# EAGLE design main v0.03 (EAGLE 6.3)
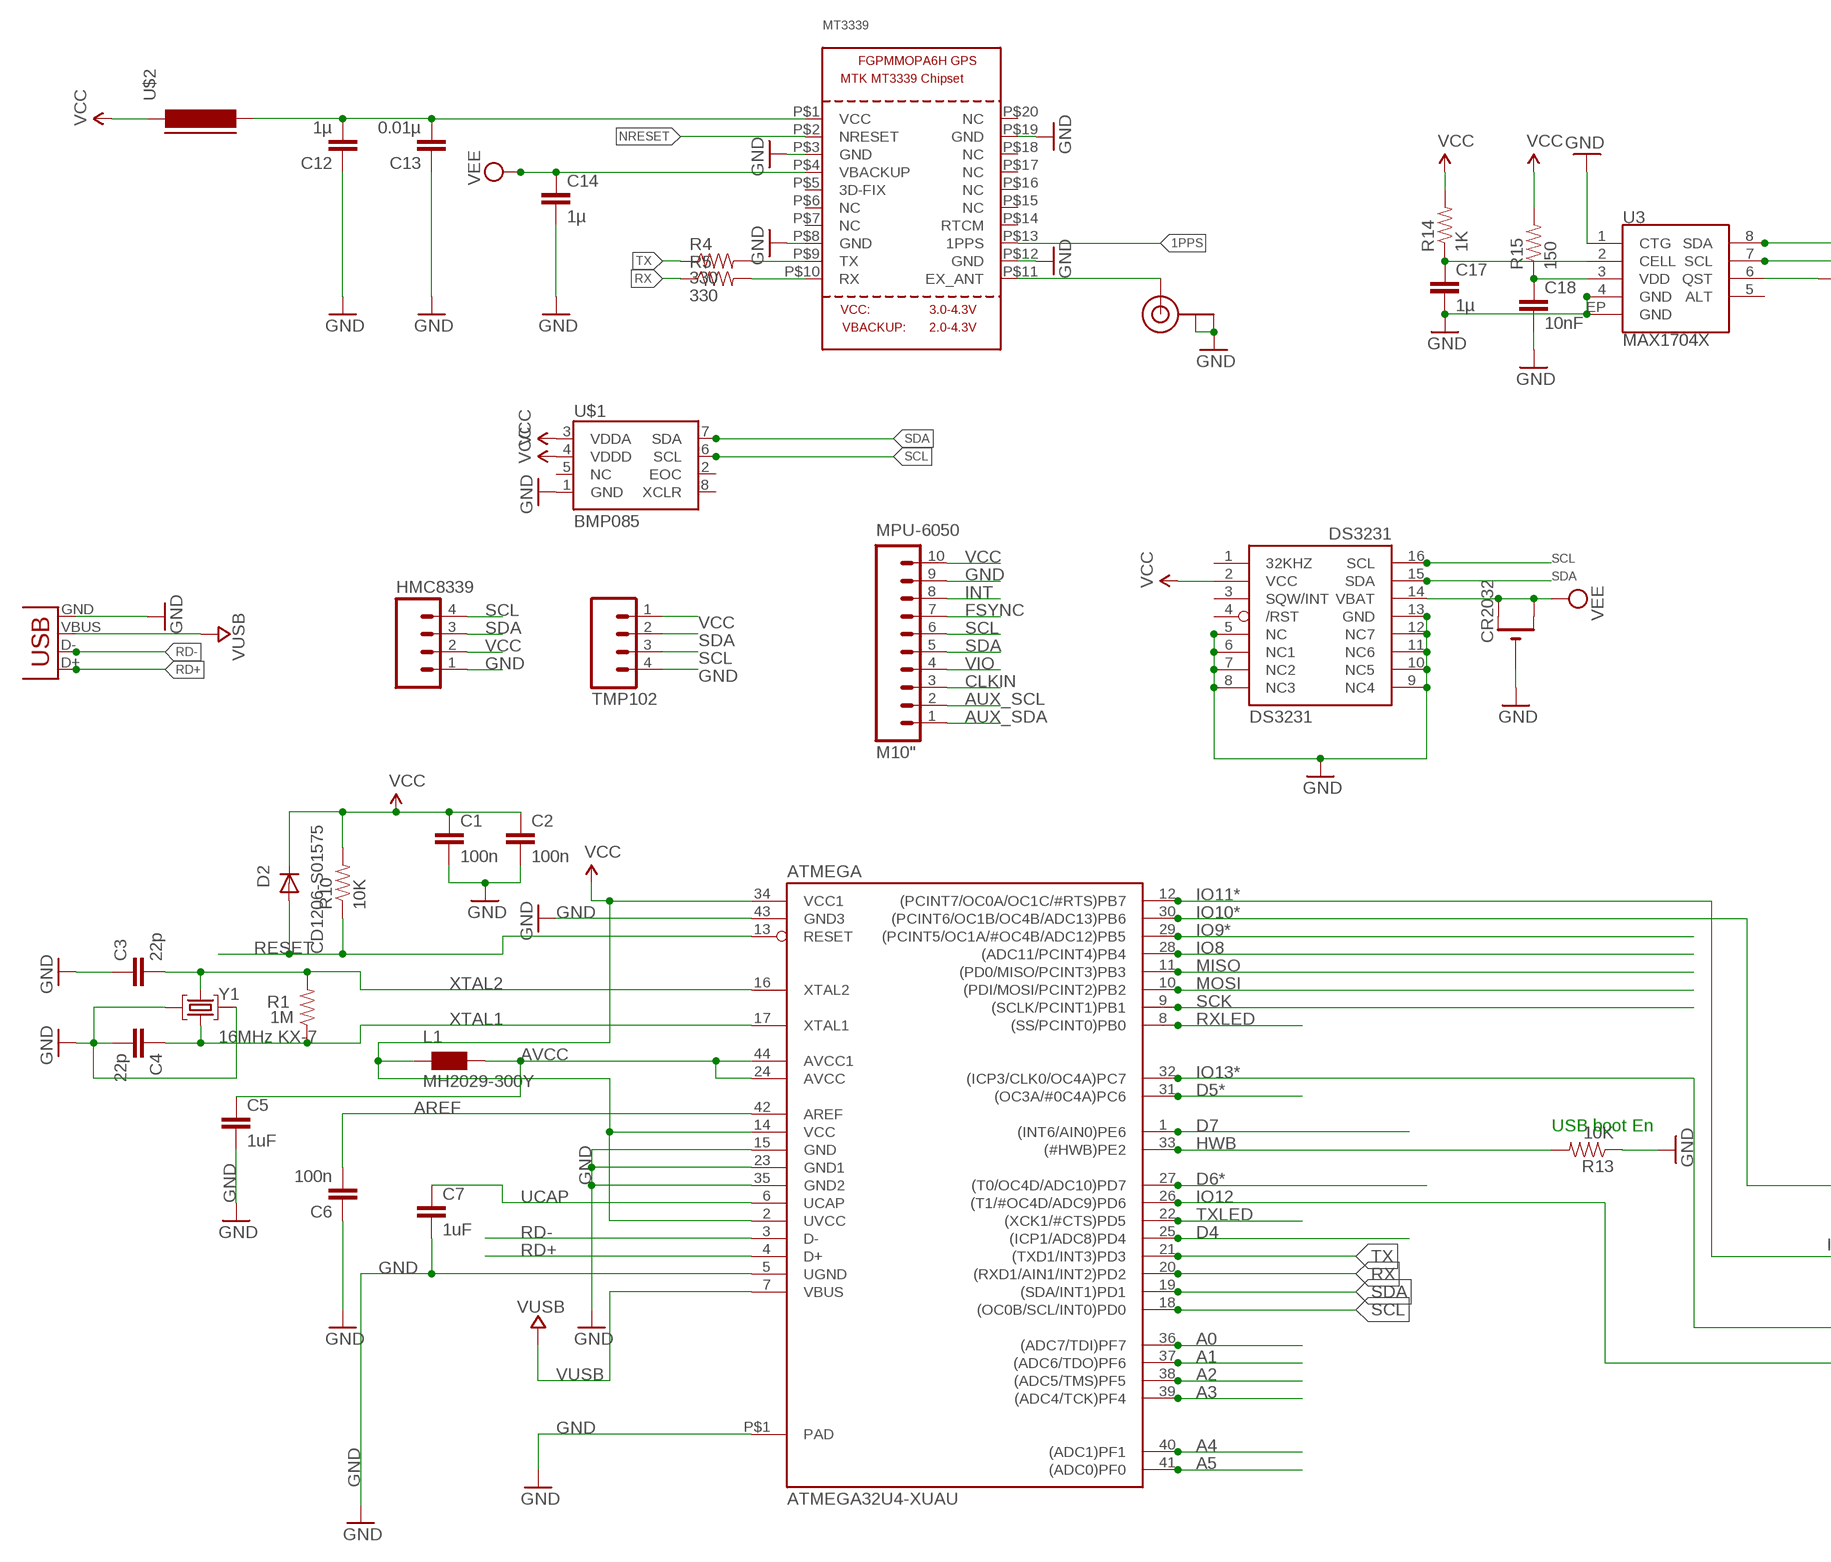
[diagram p0: schematic, sheet 1, part 1 of 2]
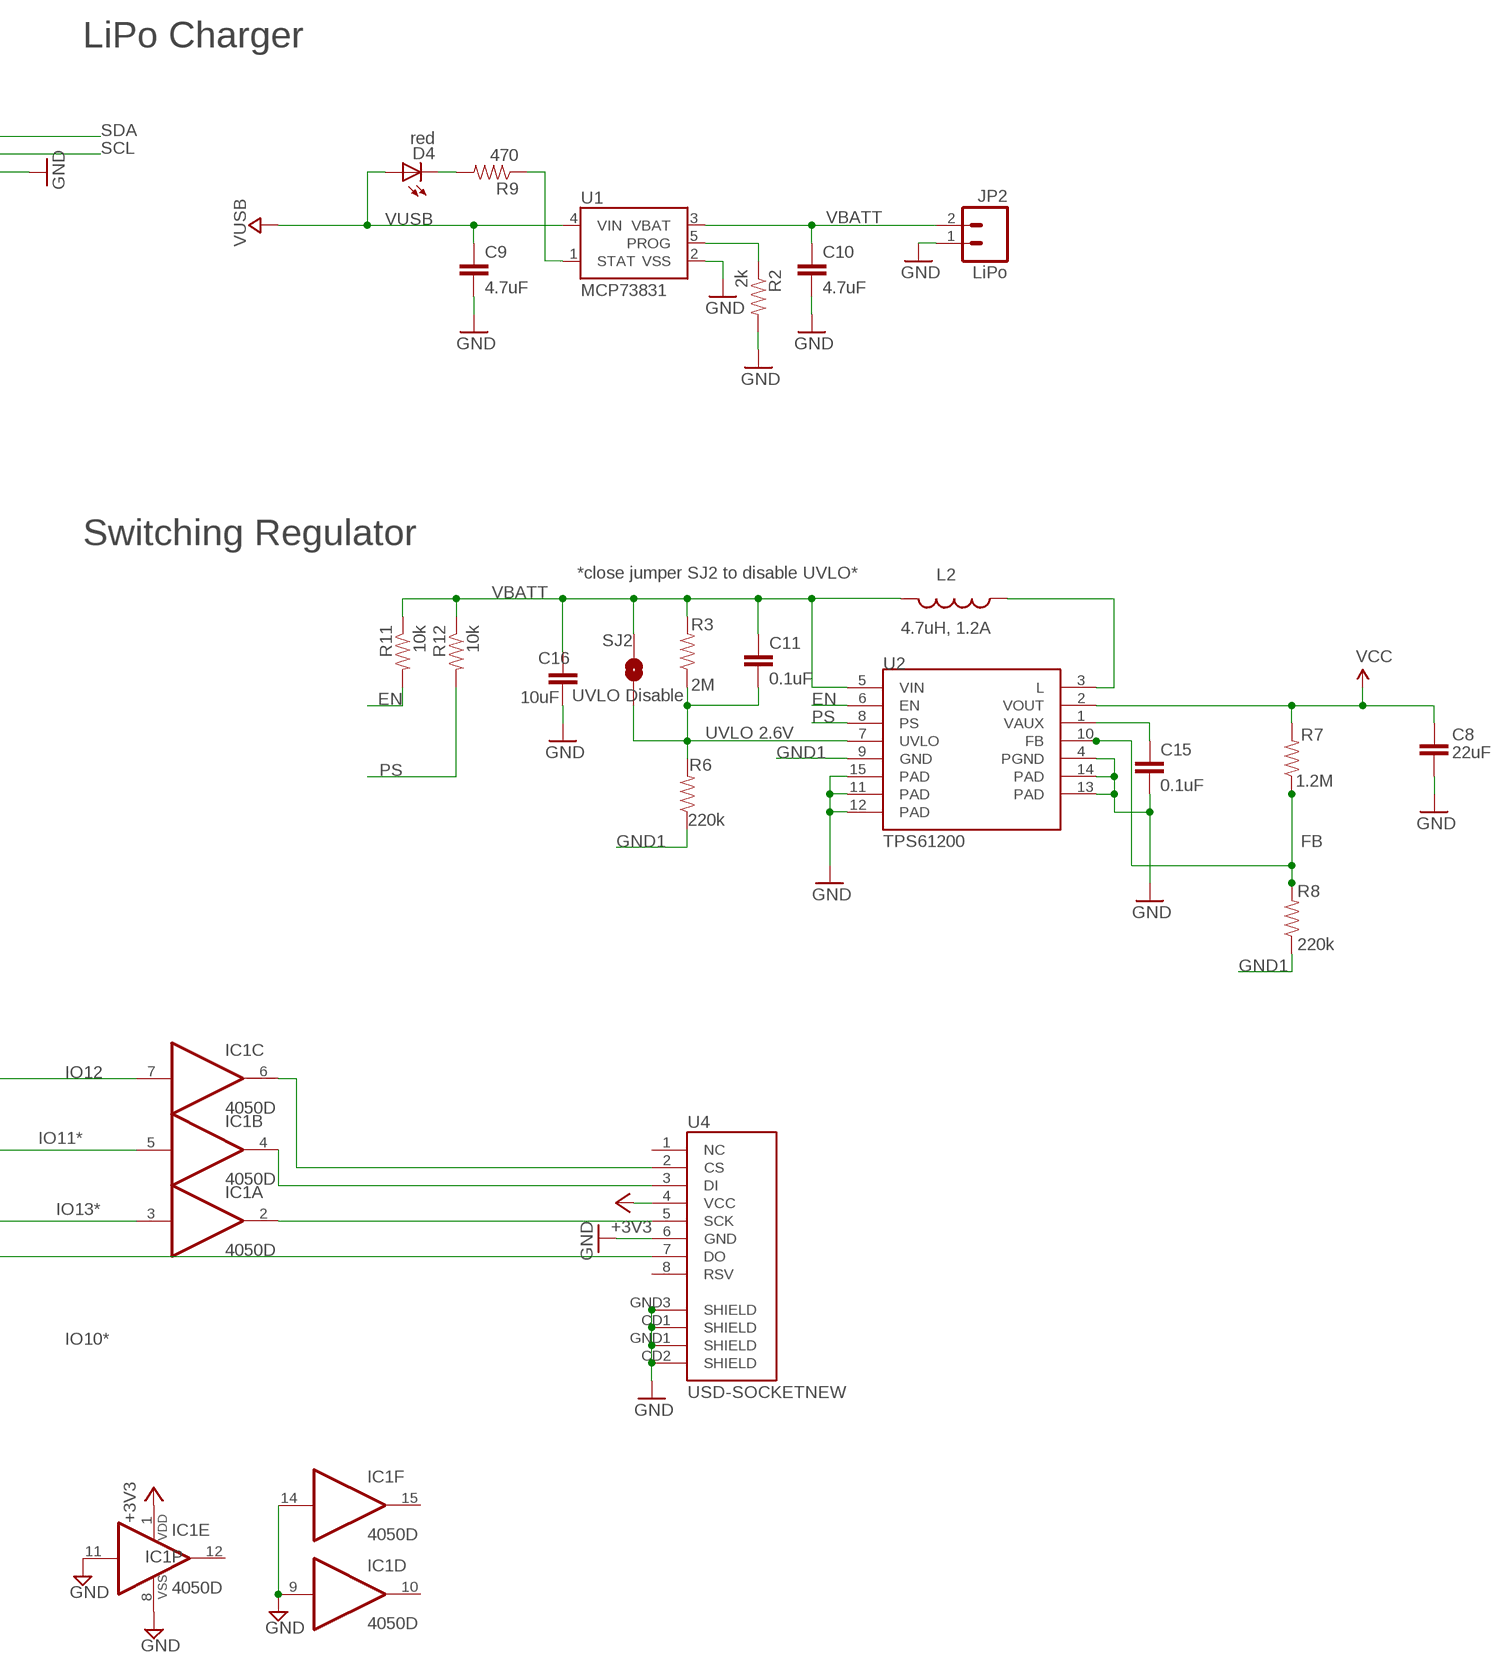
[diagram p1: schematic, sheet 1, part 2 of 2]

## Parts
ATMEGA  ATMEGA32U4-XUAU  [TQFP44-PAD]
C1  100n  CAP0805  [0805]
C2  100n  CAP0805  [0805]
C3  22p  CAP0805  [0805]
C4  22p  CAP0805  [0805]
C5  1uF  CAP0805  [0805]
C6  100n  CAP0805  [0805]
C7  1uF  CAP0805  [0805]
C8  22uF  CAP0805  [0805]
C9  4.7uF  CAP0805  [0805]
C10  4.7uF  CAP0805  [0805]
C11  0.1uF  CAP0805  [0805]
C12  1µ  CAP0805  [0805]
C13  0.01µ  CAP0805  [0805]
C14  1µ  CAP0805  [0805]
C15  0.1uF  CAP0805  [0805]
C16  10uF  CAP0805  [0805]
C17  1µ  CAP0805  [0805]
C18  10nF  CAP0805  [0805]
CR2032  CR2032SMT  [CR2032-SMD]
D2  CD1206-S01575  DIODE-MINIMELF  [MINIMELF]
D4  red  LED1206  [LED-1206]
DS3231  DS3231/SO  [SO16W]
HMC8339  M04PTH  [1X04]
IC1  4050D  [SO16]
JP2  LiPo  M02-JST-2MM-SMT  [JST-2-SMD]
L1  MH2029-300Y  WE-CBF_0805  [0805]
L2  4.7uH, 1.2A  INDUCTOR.  [CDRH2D09]
MPU-6050  M10"  [1X10]
MT3339  GPS_FGPMMOPA6H  [FGPMMOPA6H]
R1  1M  RESISTOR0805-RES  [0805]
R2  2k  RESISTOR0805-RES  [0805]
R3  2M  RESISTOR0805-RES  [0805]
R4  330  RESISTOR0805-RES  [0805]
R5  330  RESISTOR0805-RES  [0805]
R6  220k  RESISTOR0805-RES  [0805]
R7  1.2M  RESISTOR0805-RES  [0805]
R8  220k  RESISTOR0805-RES  [0805]
R9  470  RESISTOR0805-RES  [0805]
R10  10K  RESISTOR0805-RES  [0805]
R11  10k  RESISTOR0805-RES  [0805]
R12  10k  RESISTOR0805-RES  [0805]
R13  10K  RESISTOR0805-RES  [0805]
R14  1K  RESISTOR0805-RES  [0805]
R15  150  RESISTOR0805-RES  [0805]
SJ2  UVLO Disable  SOLDERJUMPERNO  [SJ_2S-NO]
TMP102  M04PTH  [1X04]
U1  MCP73831  [SOT23-5]
U2  TPS61200  [QFN-10_PAD]
U3  MAX1704X  [TDFN-8]
U4  USD-SOCKETNEW  [MICRO-SD-SOCKET-PP]
U$1  BMP085  [BMP085]
U$2  FERRITE-1206  [FB1206]
U$3  U.FL  [U.FL]
X1  USB-MICROB  [USB-MICROB]
Y1  16MHz KX-7  CRYSTAL-3.2-2.5  [CRYSTAL-3.2-2.5]

## Nets
1PPS: MT3339.P$13(1PPS)
+3V3: IC1.1(P:VDD) U4.4(VCC)
A0: ATMEGA.36((ADC7/TDI)PF7)
A1: ATMEGA.37((ADC6/TDO)PF6)
A2: ATMEGA.38((ADC5/TMS)PF5)
A3: ATMEGA.39((ADC4/TCK)PF4)
A4: ATMEGA.40((ADC1)PF1)
A5: ATMEGA.41((ADC0)PF0)
AREF: ATMEGA.42(AREF) C6.2
AUX_SCL: MPU-6050.2
AUX_SDA: MPU-6050.1
AVCC: ATMEGA.24(AVCC) ATMEGA.44(AVCC1) C5.1 L1.2
CLKIN: MPU-6050.3
D4: ATMEGA.25((ICP1/ADC8)PD4)
D5*: ATMEGA.31((OC3A/#0C4A)PC6)
D6*: ATMEGA.27((T0/OC4D/ADC10)PD7)
D7: ATMEGA.1((INT6/AIN0)PE6)
EN: R11.2 U2.6(EN)
FB: R7.1 R8.2 U2.10(FB)
FSYNC: MPU-6050.7
GND: ATMEGA.5(UGND) ATMEGA.15(GND) ATMEGA.23(GND1) ATMEGA.35(GND2) ATMEGA.43(GND3) ATMEGA.P$1(PAD) C1.2 C2.2 C3.1 C4.2 C5.2 C6.1 C7.2 C8.2 C9.2 C10.2 C12.1 C13.1 C14.2 C15.2 C16.2 C17.2 C18.2 CR2032.- DS3231.5(NC) DS3231.6(NC1) DS3231.7(NC2) DS3231.8(NC3) DS3231.9(NC4) DS3231.10(NC5) DS3231.11(NC6) DS3231.12(NC7) DS3231.13(GND) HMC8339.1 IC1.8(P:VSS) IC1.9(D:I) IC1.11(E:I) IC1.14(F:I) JP2.1 MPU-6050.9 MT3339.P$3(GND) MT3339.P$8(GND) MT3339.P$12(GND) MT3339.P$19(GND) R2.2 R13.1 TMP102.4 U1.2(VSS) U2.4(PGND) U2.11(PAD) U2.12(PAD) U2.13(PAD) U2.14(PAD) U2.15(PAD) U3.1(CTG) U3.4(GND) U3.6(QST) U3.EP(GND) U4.6(GND) U4.CD1(SHIELD) U4.CD2(SHIELD) U4.GND1(SHIELD) U4.GND3(SHIELD) U$1.1(GND) U$3.P$1(GND) U$3.P$2(GND) X1.GND Y1.2(GND) Y1.4(GND)
GND1: R6.1 R8.1 U2.9(GND)
HWB: ATMEGA.33((#HWB)PE2) R13.2
INT: MPU-6050.8
IO8: ATMEGA.28((ADC11/PCINT4)PB4)
IO9*: ATMEGA.29((PCINT5/OC1A/#OC4B/ADC12)PB5)
IO10*: ATMEGA.30((PCINT6/OC1B/OC4B/ADC13)PB6) IC1.7(C:I)
IO11*: ATMEGA.12((PCINT7/OC0A/OC1C/#RTS)PB7) IC1.5(B:I)
IO12: ATMEGA.26((T1/#OC4D/ADC9)PD6) U4.7(DO)
IO13*: ATMEGA.32((ICP3/CLK0/OC4A)PC7) IC1.3(A:I)
MISO: ATMEGA.11((PD0/MISO/PCINT3)PB3)
MOSI: ATMEGA.10((PDI/MOSI/PCINT2)PB2)
N$1: MT3339.P$11(EX_ANT) U$3.P$3(SIGNAL)
N$2: D4.C R9.2
N$3: L2.P$1 U2.3(L)
N$4: C15.1 U2.1(VAUX)
N$5: C17.1 R14.1 U3.2(CELL)
N$6: IC1.4(B:O) U4.3(DI)
N$7: MT3339.P$9(TX) R4.2
N$8: MT3339.P$10(RX) R5.2
N$9: C12.2 C13.2 MT3339.P$1(VCC) U$2.2
N$10: C18.1 R15.1 U3.3(VDD)
N$11: R2.1 U1.5(PROG)
N$12: IC1.2(A:O) U4.5(SCK)
N$13: IC1.6(C:O) U4.2(CS)
N$14: R9.1 U1.1(STAT)
NRESET: MT3339.P$2(NRESET)
PS: R12.2 U2.8(PS)
RD+: ATMEGA.4(D+) X1.D+
RD-: ATMEGA.3(D-) X1.D-
RESET: ATMEGA.13(RESET) D2.A R10.1
RX: ATMEGA.20((RXD1/AIN1/INT2)PD2) R5.1
RXLED: ATMEGA.8((SS/PCINT0)PB0)
SCK: ATMEGA.9((SCLK/PCINT1)PB1)
SCL: ATMEGA.18((OC0B/SCL/INT0)PD0) DS3231.16(SCL) HMC8339.4 MPU-6050.6 TMP102.3 U3.7(SCL) U$1.6(SCL)
SDA: ATMEGA.19((SDA/INT1)PD1) DS3231.15(SDA) HMC8339.3 MPU-6050.5 TMP102.2 U3.8(SDA) U$1.7(SDA)
TX: ATMEGA.21((TXD1/INT3)PD3) R4.1
TXLED: ATMEGA.22((XCK1/#CTS)PD5)
UCAP: ATMEGA.6(UCAP) C7.1
UVLO: C11.2 R3.1 R6.2 SJ2.1 U2.7(UVLO)
VBATT: C10.1 C11.1 C16.1 JP2.2 L2.P$2 R3.2 R11.1 R12.1 SJ2.2 U1.3(VBAT) U2.5(VIN)
VCC: ATMEGA.2(UVCC) ATMEGA.14(VCC) ATMEGA.34(VCC1) C1.1 C2.1 C8.1 D2.C DS3231.2(VCC) HMC8339.2 L1.1 MPU-6050.10 R7.2 R10.2 R14.2 R15.2 TMP102.1 U2.2(VOUT) U$1.3(VDDA) U$1.4(VDDD) U$2.1
VEE: C14.1 CR2032.+$1(+) CR2032.+$2(+1) DS3231.14(VBAT) MT3339.P$4(VBACKUP)
VIO: MPU-6050.4
VUSB: ATMEGA.7(VBUS) C9.1 D4.A U1.4(VIN) X1.VBUS
XTAL1: ATMEGA.17(XTAL1) C4.1 R1.1 Y1.1(C1)
XTAL2: ATMEGA.16(XTAL2) C3.2 R1.2 Y1.3(C2)
Unconnected: DS3231.1(32KHZ) DS3231.3(SQW/INT) DS3231.4(/RST) IC1.10(D:O) IC1.12(E:O) IC1.15(F:O) MT3339.P$5(3D-FIX) MT3339.P$6(NC) MT3339.P$7(NC) MT3339.P$14(RTCM) MT3339.P$15(NC) MT3339.P$16(NC) MT3339.P$17(NC) MT3339.P$18(NC) MT3339.P$20(NC) U3.5(ALT) U4.1(NC) U4.8(RSV) U$1.2(EOC) U$1.5(NC) U$1.8(XCLR)

## Notes on the sheet
- LiPo Charger
- Switching Regulator
- *close jumper SJ2 to disable UVLO*
- UVLO 2.6V
- USB boot En

## Library data of the parts
ATMEGA = SmartPrj:ATMEGA32U4-XU
C1-C18 = SparkFun:CAP: Capacitor Standard 0603 ceramic capacitor, and 0.1" leaded capacitor.
CR2032 = adafruit:CR2032
D2 = diode:DIODE-: DIODE
D4 = SparkFun:LED: LEDs Standard schematic elements and footprints for 5mm, 3mm, 1206, and 0603 sized LEDs. 5mm - Spark Fun Electronics SKU : COM-00529 (and others)
DS3231 = adafruit:DS3231
HMC8339 TMP102 = SparkFun:M04: Header 4 Standard 4-pin 0.1" header. Use with straight break away headers (SKU : PRT-00116), right angle break away headers (PRT-00553), swiss pins (PRT-00743), machine pins (PRT-00117), and female headers (PRT-00115). Molex polarized connector foot print use with SKU : PRT-08231 with associated crimp pins and housings. 1MM SMD Version SKU: PRT-10208
IC1 = 40xx:4050: Hex non-inverting BUFFER
JP2 = SparkFun:M02: Header 2 Standard 2-pin 0.1" header. Use with straight break away headers (SKU : PRT-00116), right angle break away headers (PRT-00553), swiss pins (PRT-00743), machine pins (PRT-00117), and female headers (PRT-00115). Molex polarized connector foot print use with SKU : PRT-08233 with associated crimp pins and housings.
L1 = wuerth-elektronik:WE-CBF: SMD EMI Suppression Ferrite Beads - excellent anti-EMI properties - low DCR - impedances till 3000 ohms - rated current up to 6 A
L2 = SparkFun:INDUCTOR: Inductors Basic Inductor/Choke - 0603 and 1206. Footprints are not proven and vary greatly between part numbers.
MPU-6050 = SparkFun:M10: Header 10 Standard 10-pin 0.1" header. Use with straight break away headers (SKU : PRT-00116), right angle break away headers (PRT-00553), swiss pins (PRT-00743), machine pins (PRT-00117), and female headers (PRT-00115).
MT3339 = adafruit:GPS_FGPMMOPA6H: GPS Module - MTK MT3339 Chipset, -165dBm sensitivity, 22 channels, 10Hz, auto-select external antenna options
R1-R15 = SparkFun:RESISTOR: Resistor Basic schematic elements and footprints for 0603, 1206, and PTH resistors.
SJ2 = SparkFun-Passives:SOLDERJUMPER: Solder Jumper Standard SMD solder jumper. Used to automate production. Two varients : Normally Open and Normally Closed are the same, but have different paste layers. NC will have a large amount of paste and should jumper during reflow.
U1 = SparkFun:MCP73831: Microchip's MCP73831 Miniature single cell, fully integrated Li-Ion, Li-polymer charge management controller http://ww1.microchip.com/downloads/en/DeviceDoc/21984a.pdf
U2 = SparkFun:TPS61200: DC to DC Booster
U3 = SparkFun-PowerIC:MAX1704X: MAX17043/MAX17044: Battery Fuel Guage (43 is 1cell, 44 is 2cell)
U4 = SparkFun-Connectors:USD-SOCKET: microSD Socket Push-push type uSD socket. Schematic element and footprint production proven. Spark Fun Electronics SKU : PRT-00127. tDoc lines correctly indicate media card edge positions when inserting (unlocked, locked, depressed).
U$1 = SparkFun:BMP085: BMP085 Pressure Sensor Great little MEMS pressure sensor. SKU: COM-09603
U$2 = dp_devices:FERRITE: Ferrite bead in various packages
U$3 = SparkFun:U.FL
X1 = SparkFun:USB: USB Connectors USB-B-PTH is fully proven SKU : PRT-00139 USB-miniB is fully proven SKU : PRT-00587 USB-A-PCB is untested. USB-A-H is throughly reviewed, but untested. Spark Fun Electronics SKU : PRT-00437 USB-B-SMT is throughly reviewed, but untested. Needs silkscreen touching up. USB-A-S has not been used/tested USB-MB-H has not been used/tested
Y1 = SmartPrj:CRYSTAL-3.2-2.5

## Board
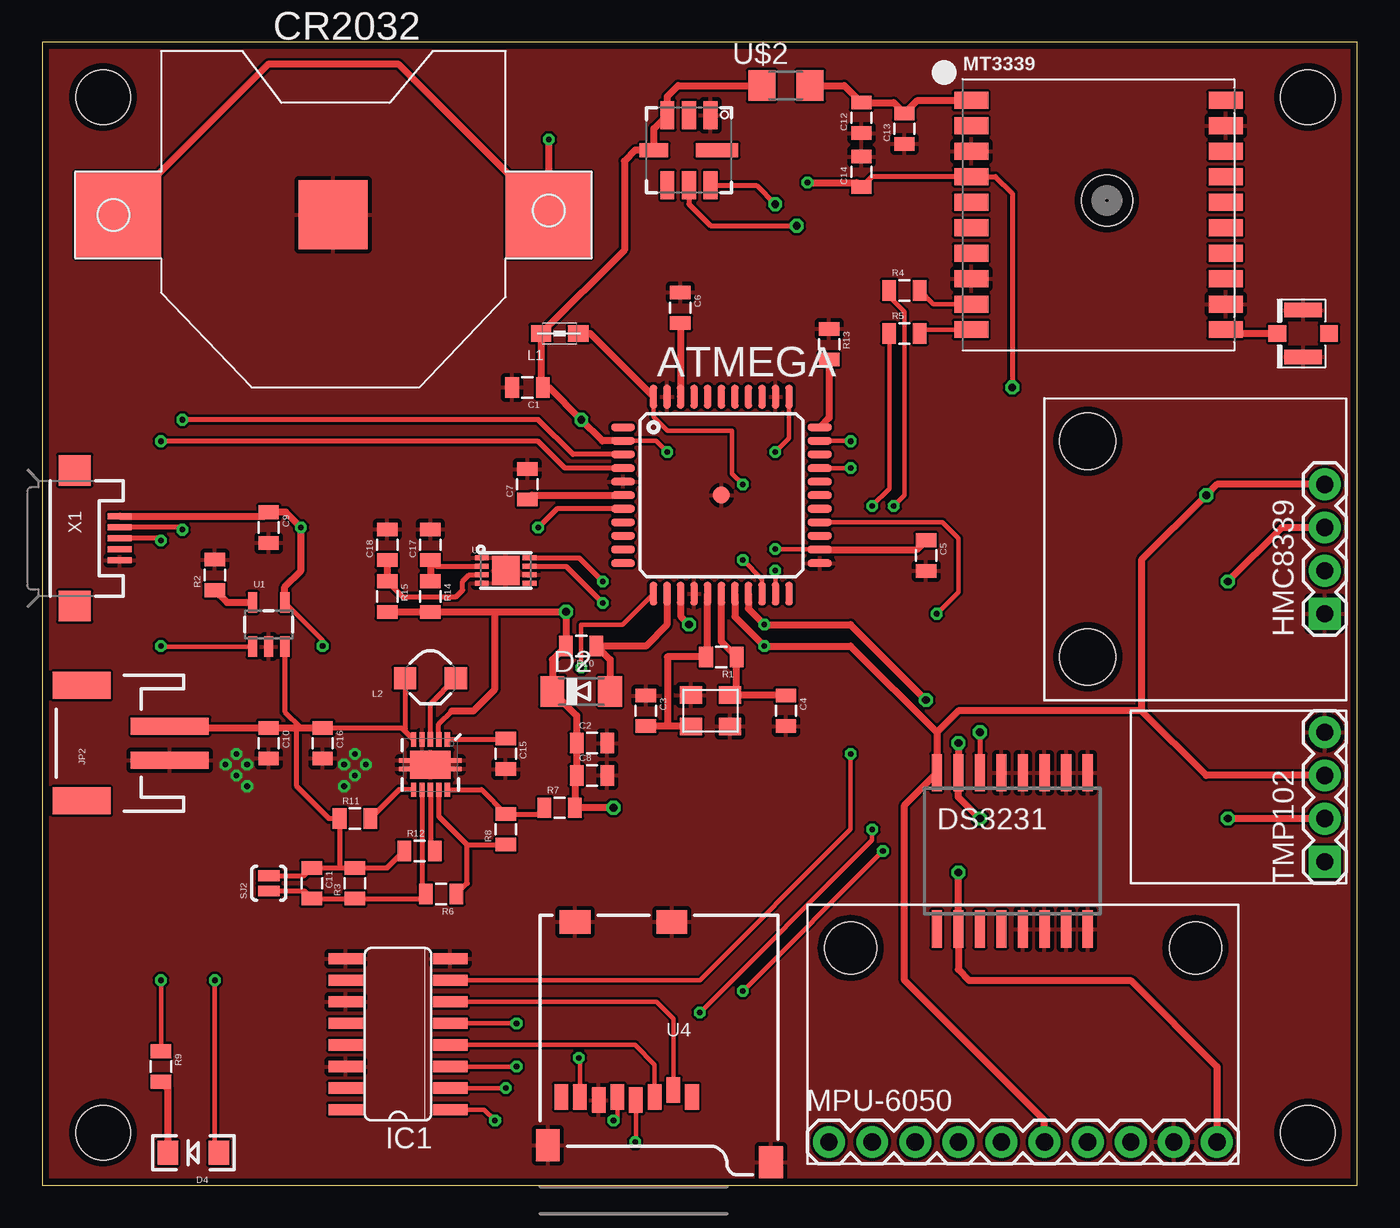
[diagram p2: board, top side]
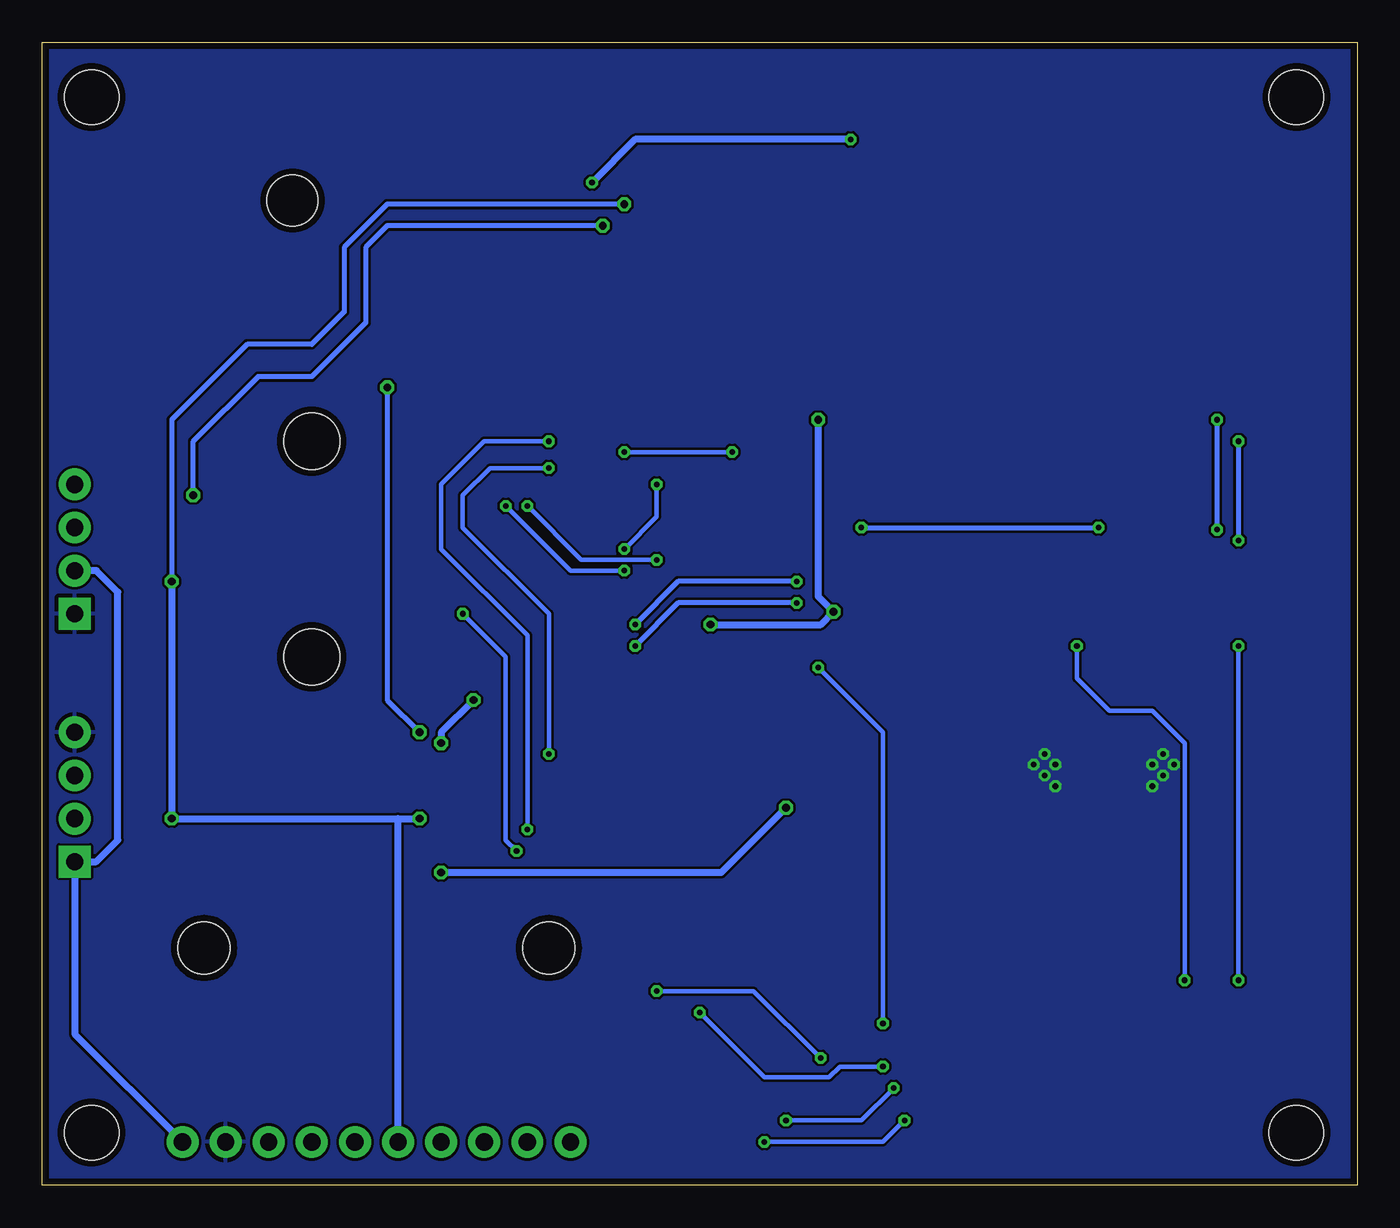
[diagram p3: board, bottom side, seen from below]

Size 77.47 x 67.31 mm. Coordinates in mm from the lower left corner, seen from the top.
Outline: 0,0 77.47,0 77.47,67.31 0,67.31 0,0
Copper layers (1*16): Top 0.0356mm / dielectric 1.5011mm / Bottom 0.0356mm
Design rules "LaenPCBOrder": minimum track width 6mil, minimum drill 13mil, track to track 6mil, track to pad 6mil, pad to pad 6mil, via to via 6mil, smd to smd 6mil, copper to edge 15mil, drill to drill 6mil, minimum pad ring 7mil, minimum via ring 7mil, stop-mask expansion 4mil, vias tented up to drill 0mil, thermal gap 10mil
Holes 3.2 mm at 3.58,64.09 3.58,3.1 74.58,3.1 74.58,64.09

### Footprints (pad centres in the part's own frame; a part is rotated, then mirrored left to right if it is on the bottom)
TQFP44-PAD = smd 1.4 x 0.45: 1 -5.8,4; 2 -5.8,3.2; 3 -5.8,2.4; 4 -5.8,1.6; 5 -5.8,0.8; 6 -5.8,0; 7 -5.8,-0.8; 8 -5.8,-1.6; 9 -5.8,-2.4; 10 -5.8,-3.2; 11 -5.8,-4; 23 5.8,-4; 24 5.8,-3.2; 25 5.8,-2.4; 26 5.8,-1.6; 27 5.8,-0.8; 28 5.8,0; 29 5.8,0.8; 30 5.8,1.6; 31 5.8,2.4; 32 5.8,3.2; 33 5.8,4 | smd 0.45 x 1.4: 12 -4,-5.8; 13 -3.2,-5.8; 14 -2.4,-5.8; 15 -1.6,-5.8; 16 -0.8,-5.8; 17 0,-5.8; 18 0.8,-5.8; 19 1.6,-5.8; 20 2.4,-5.8; 21 3.2,-5.8; 22 4,-5.8; 34 4,5.8; 35 3.2,5.8; 36 2.4,5.8; 37 1.6,5.8; 38 0.8,5.8; 39 0,5.8; 40 -0.8,5.8; 41 -1.6,5.8; 42 -2.4,5.8; 43 -3.2,5.8; 44 -4,5.8 | smd 1 x 1: P$1 0,0
0805 = smd 0.8 x 1.2: 1 -0.9,0; 2 0.9,0
CR2032-SMD = smd 5.08 x 5.08: +$1 -12.7,0; +$2 12.7,0 | smd 4.064 x 4.064: - 0,0
MINIMELF = smd 1.4 x 1.8: A 1.7,0; C -1.7,0
LED-1206 = smd 1.2 x 1.4: A -1.5,0; C 1.5,0
SO16W = smd 0.6 x 2.2: 1 -4.445,-4.6; 2 -3.175,-4.6; 3 -1.905,-4.6; 4 -0.635,-4.6; 5 0.635,-4.6; 6 1.905,-4.6; 7 3.175,-4.6; 8 4.445,-4.6; 9 4.445,4.6; 10 3.175,4.6; 11 1.905,4.6; 12 0.635,4.6; 13 -0.635,4.6; 14 -1.905,4.6; 15 -3.175,4.6; 16 -4.445,4.6
1X04 = drill 1.016 pad 1.88 square: 1 0,0 | drill 1.016 pad 1.88: 2 2.54,0; 3 5.08,0; 4 7.62,0
SO16 = smd 0.66 x 2.032: 1 -4.445,-3.073; 2 -3.175,-3.073; 3 -1.905,-3.073; 4 -0.635,-3.073; 5 0.635,-3.073; 6 1.905,-3.073; 7 3.175,-3.073; 8 4.445,-3.073; 9 4.445,3.073; 10 3.175,3.073; 11 1.905,3.073; 12 0.635,3.073; 13 -0.635,3.073; 14 -1.905,3.073; 15 -3.175,3.073; 16 -4.445,3.073
STAND-OFF = hole 3.302: 0,0
JST-2-SMD = smd 1 x 4.6: 1 -1,-3.7; 2 1,-3.7 | smd 1.6 x 3.4: NC1 -3.4,1.5; NC2 3.4,1.5
STAND-OFF-TIGHT = hole 3.048: 0,0
0805' = smd 1.2 x 1: 1 -1.1,0; 2 1.1,0
CDRH2D09 = smd 1.3 x 1.3: P$1 -1.5,0; P$2 1.5,0
1X10 = drill 1.016 pad 1.88: 1 0,0; 2 2.54,0; 3 5.08,0; 4 7.62,0; 5 10.16,0; 6 12.7,0; 7 15.24,0; 8 17.78,0; 9 20.32,0; 10 22.86,0
FGPMMOPA6H = smd 2 x 1: P$1 -7.5,6.75; P$2 -7.5,5.25; P$3 -7.5,3.75; P$4 -7.5,2.25; P$5 -7.5,0.75; P$6 -7.5,-0.75; P$7 -7.5,-2.25; P$8 -7.5,-3.75; P$9 -7.5,-5.25; P$10 -7.5,-6.75; P$11 7.5,-6.75; P$12 7.5,-5.25; P$13 7.5,-3.75; P$14 7.5,-2.25; P$15 7.5,-0.75; P$16 7.5,0.75; P$17 7.5,2.25; P$18 7.5,3.75; P$19 7.5,5.25; P$20 7.5,6.75 | hole 3: 0.5,0.85
SJ_2S-NO = smd 0.635 x 1.27: 1 -0.45,0; 2 0.45,0
SOT23-5 = smd 0.55 x 1.2: 1 -0.95,-1.3; 2 0,-1.3; 3 0.95,-1.3; 4 0.95,1.3; 5 -0.95,1.3
QFN-10_PAD = smd 0.297 x 0.85: 1 -1,-1.475; 2 -0.5,-1.475; 3 0,-1.475; 4 0.5,-1.475; 5 1,-1.475; 6 1,1.475; 7 0.5,1.475; 8 0,1.475; 9 -0.5,1.475; 10 -1,1.475 | smd 0.7 x 0.28: 11 -1.5,0.25; 12 -1.5,-0.25; 13 1.5,0.25; 14 1.5,-0.25 | smd 2.4 x 1.65: 15 0,0
TDFN-8 = smd 0.8 x 0.3: 1 -1.4,0.75; 2 -1.4,0.25; 3 -1.4,-0.25; 4 -1.4,-0.75; 5 1.4,-0.75; 6 1.4,-0.25; 7 1.4,0.25; 8 1.4,0.75 | smd 1.63 x 1.75: EP 0,0
MICRO-SD-SOCKET-PP = smd 0.8 x 1.5: 1 -8.94,10.7; 2 -7.84,10.3; 3 -6.74,10.7; 4 -5.64,10.9; 5 -4.54,10.7; 6 -3.44,10.9; 7 -2.34,10.7; 8 -1.24,10.7 | smd 1.8 x 1.4: CD1 -2.05,0.4; CD2 -7.75,0.4 | smd 1.4 x 1.9: GND1 -13.6,14.55; GND3 -0.45,13.55
BMP085 = smd 1.67 x 0.8: 1 -2.065,1.27; 2 -2.065,0; 3 -2.065,-1.27; 5 2.065,-1.27; 6 2.065,0; 7 2.065,1.27 | smd 0.8 x 1.67: 4 0,-2.065 | smd 0.8 x 2.5: 8 0,1.65
FB1206 = smd 1.6 x 1.803: 1 -1.422,0; 2 1.422,0
U.FL = smd 2.2 x 0.85: P$1 0,1.375; P$2 0,-1.375 | smd 1.05 x 1: P$3 1.525,0; P$4 -1.525,0
USB-MICROB = smd 0.35 x 1.4: D+ 0,2.65; D- -0.65,2.65; GND 1.3,2.65; ID 0.65,2.65; VBUS -1.3,2.65 | smd 1.8 x 1.9: MT1 -4,0; MT2 4,0
CRYSTAL-3.2-2.5 = smd 1.3 x 1.05: 1 -1.15,-0.925; 2 1.15,-0.925; 3 1.15,0.925; 4 -1.15,0.925

### Placement (x,y rotation side)
ATMEGA  40.01,40.64 0 top
C1  28.57,46.99 180 top
C2  32.38,26.04 0 top
C3  35.56,27.94 270 top
C4  43.81,27.94 270 top
C5  52.07,37.08 270 top
C6  37.59,51.69 270 top
C7  28.57,41.27 90 top
C8  32.38,24.13 0 top
C9  13.34,38.73 270 top
C10  13.34,26.04 270 top
C11  15.88,17.78 270 top
C12  48.26,62.87 90 top
C13  50.8,62.23 90 top
C14  48.26,59.69 90 top
C15  27.3,25.4 270 top
C16  16.51,26.04 270 top
C17  22.86,37.72 90 top
C18  20.32,37.72 90 top
CR2032  17.14,57.15 0 top
D2  31.75,29.08 0 top
D4  8.89,1.91 180 top
DS3231  57.15,19.68 0 top
HMC8339  75.56,33.66 90 top
IC1  20.95,8.89 90 top
JP1  STAND-OFF  [STAND-OFF]  61.59,31.11 90 top
JP2  3.81,26.04 90 top
JP5  STAND-OFF  [STAND-OFF]  61.59,43.81 90 top
JP7  STAND-OFFTIGHT  [STAND-OFF-TIGHT]  67.94,13.97 270 top
JP8  STAND-OFFTIGHT  [STAND-OFF-TIGHT]  47.62,13.97 270 top
L1  MH2029-300Y  [0805']  30.48,50.16 0 top
L2  22.86,29.84 180 top
MPU-6050  46.35,2.54 0 top
MT3339  62.23,57.15 0 top
R1  40.01,31.11 180 top
R2  10.16,35.94 90 top
R3  18.41,17.78 90 top
R4  50.8,52.7 0 top
R5  50.8,50.16 0 top
R6  23.5,17.14 180 top
R7  30.48,22.23 0 top
R8  27.3,20.95 90 top
R9  6.99,6.99 270 top
R10  31.75,31.75 180 top
R11  18.41,21.59 0 top
R12  22.23,19.68 0 top
R13  46.35,49.53 270 top
R14  22.86,34.67 270 top
R15  20.32,34.67 270 top
SJ2  13.34,17.78 90 top
TMP102  75.56,19.05 90 top
U1  13.34,33.02 0 top
U2  22.86,24.77 180 top
U3  27.3,36.2 0 top
U4  29.34,15.9 180 top
U$1  38.1,60.96 270 top
U$2  43.81,64.77 0 top
U$3  74.3,50.16 180 top
X1  1.91,38.1 270 top
Y1  39.37,27.94 180 top

### Tracks (layer width: path | path; a pad name or v marks a point on that pad's centre or on a via)
+3V3  (via drill 0.33)
  Top 0.254: IC1.1 26.04,4.45 v26.67,3.81 | U4.4 34.98,2.59 v34.92,2.54
  Top 0.406: v34.92,2.54 34.91,2.56
  Bottom 0.254: v26.67,3.81 27.94,2.54 v34.92,2.54
AREF
  Top 0.406: C6.2 37.59,46.45 ATMEGA.42
AVCC  (via drill 0.33)
  Top 0.254: ATMEGA.44 36.01,45.27 36.83,44.45 40.64,44.45 40.64,41.91 v41.27,41.27 | v43.18,37.47 45.78,37.47
  Top 0.406: C5.1 51.53,37.44 ATMEGA.24 45.78,37.47 | L1.2 32.28,50.16 ATMEGA.44
  Bottom 0.254: v41.27,41.27 41.27,39.37 v43.18,37.47
EN
  Top 0.305: U2.6 21.02,23.29 R11.2
FB
  Top 0.305: U2.10 25.87,23.29 R8.2 29.21,21.86 R7.1
GND  (via drill 0.33)
  Top 0.305: U2.13 22.61,24.52 U2.15 23.11,25.02 U2.12
  other vias: 19.05,24.77 18.41,24.13 17.78,23.5 11.43,25.4 10.79,24.77 11.43,24.13 12.06,24.77 18.41,25.4 17.78,24.77 12.06,23.5
  pour Top: 0,0 77.47,0 77.47,67.31 0,67.31
  pour Bottom: 0,0 77.47,0 77.47,67.31 0,67.31
GND1
  Top 0.305: U2.9 23.36,21.73 25.03,20.05 | 25.03,20.05 R8.1 | R6.1 25.03,17.78 25.03,20.05
HWB
  Top 0.406: R13.2 46.35,45.19 ATMEGA.33
IO10*  (via drill 0.33)
  Top 0.254: IC1.7 38.73,12.06 47.62,20.95 v47.62,25.4 | ATMEGA.30 v47.62,42.24
  Bottom 0.254: v47.62,25.4 47.62,33.66 52.7,38.73 52.7,40.64 51.1,42.24 v47.62,42.24
IO11*  (via drill 0.33)
  Top 0.254: ATMEGA.12 34.19,33.02 31.75,33.02 v31.75,30.48 | v27.94,9.53 IC1.5
  Bottom 0.254: v31.75,30.48 27.94,26.67 v27.94,9.53
IO12  (via drill 0.33)
  Top 0.254: ATMEGA.26 53.03,39.04 53.98,38.1 53.98,34.92 v52.7,33.66 | v49.53,19.68 v41.27,11.43 | U4.7 31.68,7.43 v31.61,7.49
  Bottom 0.254: v52.7,33.66 50.16,31.11 50.16,20.32 v49.53,19.68 | v41.27,11.43 35.56,11.43 31.62,7.49 v31.61,7.49
IO13*  (via drill 0.33)
  Top 0.254: ATMEGA.32 47.6,43.84 v47.62,43.81 | v48.9,20.95 48.9,20.32 v38.73,10.16 | v27.94,6.99 IC1.3
  Bottom 0.254: v47.62,43.81 51.44,43.81 53.98,41.27 53.98,37.47 48.9,32.38 v48.9,20.95 | v38.73,10.16 34.92,6.35 31.11,6.35 30.48,6.99 v27.94,6.99
N$1
  Top 0.406: MT3339.P$11 69.97,50.16 U$3.P$3
N$2
  Top 0.406: R9.2 7.39,5.68 D4.C
N$3
  Top 0.305: U2.3 22.86,28.34 L2.P$1
N$4
  Top 0.305: C15.1 27.25,26.24 U2.1
N$5
  Top 0.305: C17.1 23.23,36.45 U3.2
  Top 0.406: C17.1 R14.1
N$6
  Top 0.254: U4.3 36.08,7.1 34.92,8.26 IC1.4
N$7
  Top 0.254: MT3339.P$9 52.51,51.9 R4.2
N$8
  Top 0.254: MT3339.P$10 51.94,50.4
  Top 0.406: 51.94,50.4 R5.2
N$9
  Top 0.406: U$2.2 47.26,64.77 C12.2 50.16,63.77 C13.2 51.57,63.9 MT3339.P$1
N$10
  Top 0.305: R15.1 21.22,34.67 24.38,34.67 24.77,35.05 24.77,35.56 25.15,35.95 U3.3
  Top 0.406: C18.1 R15.1
N$11
  Top 0.406: R2.1 10.88,34.32 U1.5
N$12  (via drill 0.33)
  Top 0.254: IC1.2 v27.3,5.71 | 33.81,3.96 v33.66,3.81 33.88,4.03 U4.5
  Bottom 0.254: v27.3,5.71 29.21,3.81 v33.66,3.81
N$13
  Top 0.254: IC1.6 36.2,10.79 37.18,9.81 U4.2
N$14  (via drill 0.33)
  Top 0.254: U1.1 6.99,31.72 v6.99,31.75 | v6.99,12.06 R9.1
  Bottom 0.254: v6.99,31.75 v6.99,12.06
PS
  Top 0.305: U2.8 22.86,19.95 R12.2
RD+  (via drill 0.33)
  Top 0.305: ATMEGA.4 30.79,42.24 29.21,43.81 v6.99,43.81 | v6.99,37.97 6.86,38.1 X1.D+
  Bottom 0.305: v6.99,43.81 v6.99,37.97
RD-  (via drill 0.33)
  Top 0.305: ATMEGA.3 31.25,43.04 29.21,45.09 v8.26,45.09 | v8.26,38.61 8.11,38.75 X1.D-
  Bottom 0.305: v8.26,45.09 v8.26,38.61
RESET
  Top 0.406: D2.A 33.45,30.95 R10.1 35.56,31.75 36.8,32.99 ATMEGA.13
RX  (via drill 0.33)
  Top 0.254: ATMEGA.20 42.41,35.7 v41.27,36.83 | R5.1 49.9,41.01 v48.9,40.01
  Bottom 0.254: v41.27,36.83 45.72,36.83 v48.9,40.01
SCL  (via drill 0.33, 0.46)
  Top 0.305: U$1.6 38.1,57.78 39.37,56.52 v44.45,56.52 | U3.7 30.86,36.45 v33.02,34.29
  Top 0.406: TMP102.3 68.58,24.13 64.77,27.94 | 64.77,27.94 53.98,27.94 52.7,26.67 | 52.7,26.67 DS3231.16 50.8,22.38 50.8,12.06 59.05,3.81 MPU-6050.6 | ATMEGA.18 40.8,33.49 41.27,33.02 v42.55,31.75 47.62,31.75 52.7,26.67 | HMC8339.4 69.22,41.27 v68.58,40.64 64.77,36.83 64.77,27.94
  Bottom 0.305: v44.45,56.52 57.15,56.52 58.42,55.24 58.42,50.8 61.59,47.62 64.77,47.62 68.58,43.81 v68.58,40.64 | v33.02,34.29 40.01,34.29 v42.55,31.75
SDA  (via drill 0.33, 0.46)
  Top 0.305: U$1.7 42.07,58.9 v43.18,57.78 | U3.8 31.64,36.95 v33.02,35.56
  Top 0.406: TMP102.2 v69.85,21.59 | v55.24,21.59 53.98,22.86 DS3231.15 v53.98,26.04 | ATMEGA.19 41.6,33.96 v42.55,33.02 47.62,33.02 v52.07,28.57 | HMC8339.3 73.03,38.73 v69.85,35.56
  Bottom 0.305: v43.18,57.78 57.15,57.78 59.69,55.24 59.69,51.44 61.59,49.53 65.41,49.53 69.85,45.09 v69.85,35.56 | v33.02,35.56 40.01,35.56 v42.55,33.02
  Bottom 0.406: 56.52,21.59 v69.85,21.59 v69.85,35.56 | 56.52,21.59 v55.24,21.59 | MPU-6050.5 56.52,21.59 | v52.07,28.57 53.98,26.67 v53.98,26.04
TX  (via drill 0.33)
  Top 0.254: 49.9,52.34 50.8,51.44 50.8,40.64 v50.16,40.01 | ATMEGA.21 43.2,36.17 v43.18,36.2
  Top 0.305: R4.1 49.9,52.34
  Bottom 0.254: v43.18,36.2 46.35,36.2 v50.16,40.01
UCAP
  Top 0.406: C7.1 28.84,40.64 ATMEGA.6
UVLO
  Top 0.305: SJ2.1 15.43,17.33 C11.2 R3.1 22.33,16.88 R6.2 22.36,17.14 U2.7
VBATT
  Top 0.305: C16.1 21.16,26.93 21.36,26.74 | 21.36,26.74 U2.5 | L2.P$2 21.36,26.74 | 15.11,26.93 14.99,26.81 14.99,23.5 16.89,21.59 R11.1 17.52,18.68 | U1.3 14.29,27.89 15.24,26.93 | SJ2.2 15.43,18.23 C11.1 17.52,18.68 | R12.1 20.32,18.68 R3.2 17.91,18.68 17.52,18.68
  Top 0.406: JP2.2 7.61,26.93 C10.1 15.11,26.93 15.24,26.93 C16.1
VCC  (via drill 0.33, 0.46)
  Top 0.254: ATMEGA.2 36.17,43.84 v36.83,43.18 | v43.18,43.18 44.01,44.01 ATMEGA.34
  Top 0.305: C8.1 31.38,24.02 | U2.2 23.36,27.17 24.13,27.94
  Top 0.406: R15.2 R14.2 26.67,33.77 | C8.1 C2.1 31.48,27.65 D2.C 30.05,30.95 R10.2 v30.85,33.77 26.67,33.77 | 31.38,24.02 R7.2 v33.66,22.23 | 24.13,27.94 25.4,27.94 26.67,29.21 26.67,33.77 | MPU-6050.10 69.22,6.99 64.14,12.06 54.61,12.06 53.98,12.7 DS3231.2 v53.98,18.41 | U$2.1 37.47,64.77 36.83,64.14 U$1.3 36.03,62.23 U$1.4 34.92,60.96 34.29,60.33 34.29,55.08 L1.1 29.38,47.09 C1.1 29.84,46.99 v31.75,45.09 32.99,43.84 ATMEGA.2 | ATMEGA.14 37.6,33.52 v38.1,33.02
  Bottom 0.254: v36.83,43.18 v43.18,43.18
  Bottom 0.406: MPU-6050.10 75.56,8.89 TMP102.1 74.3,19.05 73.03,20.32 73.03,34.92 74.3,36.2 HMC8339.2 | v53.98,18.41 37.47,18.41 v33.66,22.23 | v31.75,45.09 31.75,34.67 v30.85,33.77 31.6,33.02 v38.1,33.02
VEE  (via drill 0.33, 0.46)
  Top 0.305: C14.1 48.87,59.4 MT3339.P$4 56.17,59.4 57.15,58.42 v57.15,46.99 | v55.24,26.67 DS3231.14
  Top 0.406: CR2032.+$1 13.34,66.04 20.95,66.04 CR2032.+$2 v29.84,61.59 | v45.09,59.05 47.99,59.05 C14.1
  Bottom 0.305: v57.15,46.99 57.15,28.57 v55.24,26.67
  Bottom 0.406: v29.84,61.59 42.55,61.59 v45.09,59.05
VUSB  (via drill 0.33)
  Top 0.254: D4.A 10.16,1.91 v10.16,12.06 | v16.51,31.75 16.51,32.09 U1.4
  Top 0.305: ATMEGA.7 30.32,39.84 v29.21,38.73
  Top 0.406: X1.VBUS 13.1,39.4 C9.1 14.34,39.63 v15.24,38.73 15.24,36.2 14.29,35.24 U1.4
  Bottom 0.254: v10.16,12.06 10.16,26.04 12.06,27.94 14.61,27.94 16.51,29.84 v16.51,31.75
  Bottom 0.305: v29.21,38.73 v15.24,38.73
XTAL1
  Top 0.406: C4.1 43.79,28.86 Y1.1 40.91,29.25 R1.1 40.01,32.02 ATMEGA.17
XTAL2
  Top 0.406: Y1.3 38.2,27.04 36.83,27.04 | 36.83,27.04 C3.2 | ATMEGA.16 39.2,31.21 R1.2 36.83,31.11 36.83,27.04